# Altium schematic sheet Charging_Dock.SchDoc
size B; SheetNumber: 1; SheetTotal: 1
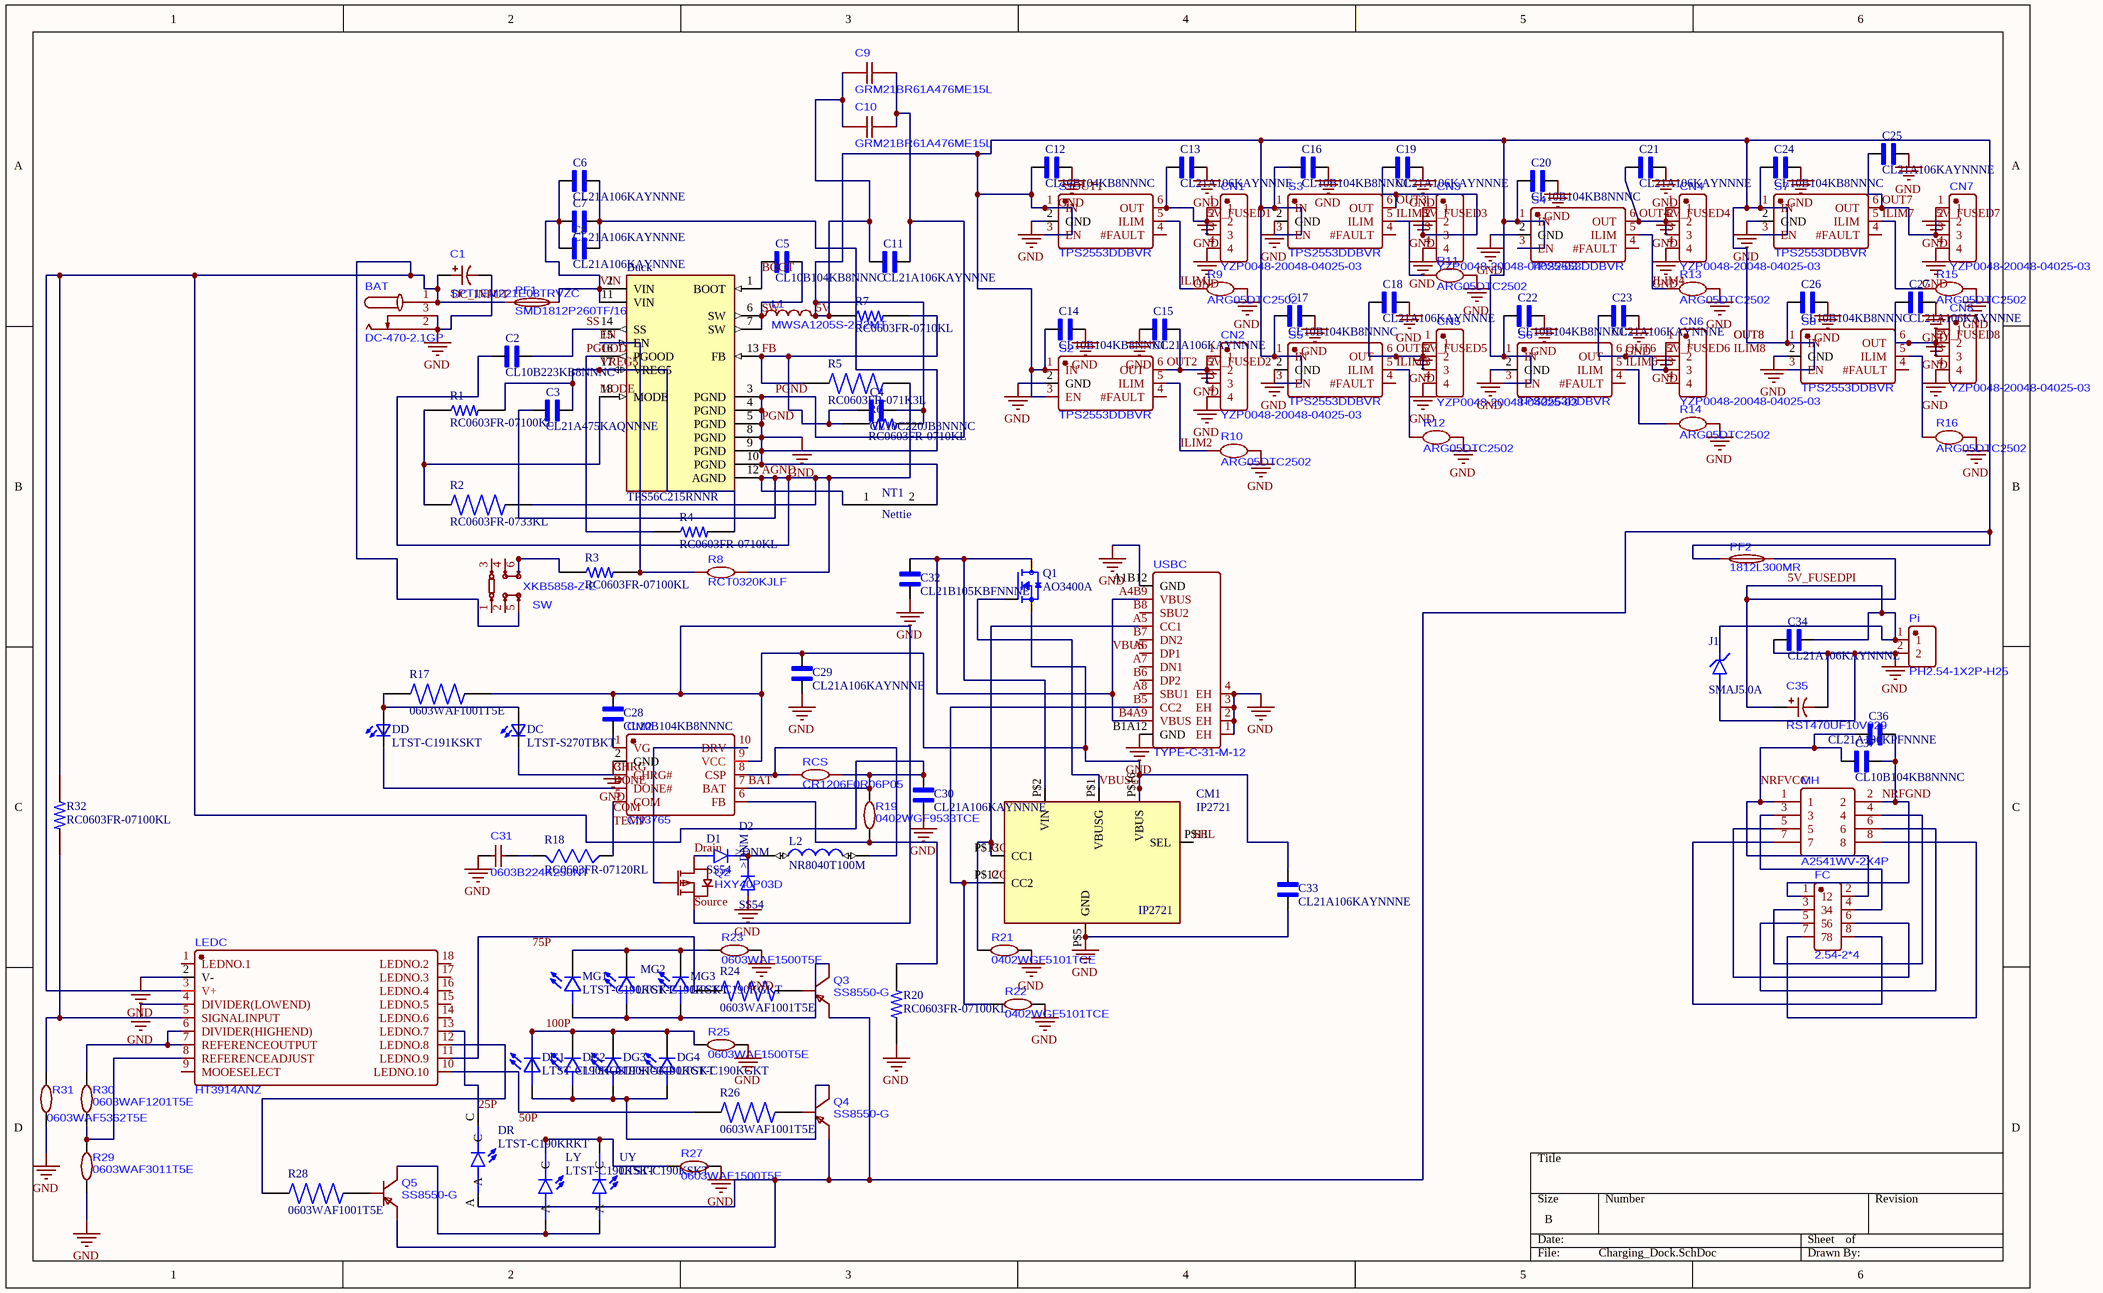
[diagram p0: Charging_Dock.SchDoc]

## Parts
BAT  DC-470-2.1GP  [DC-IN-TH_DC-470-2.1GP]
Buck  TPS56C215RNNR  [QFN50P350X350X100-18N]
C1  SPT1EM221E08TRVZC  [CAP-SMD_BD6.3-L6.6-W6.6-LS7.3-FD]
C2  CL10B223KB8NNNC  [CAPC1608X90N]
C3  CL21A475KAQNNNE  [CAPC2012X140N]
C4  CL10C220JB8NNNC  [CAPC1608X90N]
C5  CL10B104KB8NNNC  [CAPC1608X90N]
C6  CL21A106KAYNNNE  [CAPC2012X145N]
C7  CL21A106KAYNNNE  [CAPC2012X145N]
C8  CL21A106KAYNNNE  [CAPC2012X145N]
C9  GRM21BR61A476ME15L  [C0805]
C10  GRM21BR61A476ME15L  [C0805]
C11  CL21A106KAYNNNE  [CAPC2012X145N]
C12  CL10B104KB8NNNC  [CAPC1608X90N]
C13  CL21A106KAYNNNE  [CAPC2012X145N]
C14  CL10B104KB8NNNC  [CAPC1608X90N]
C15  CL21A106KAYNNNE  [CAPC2012X145N]
C16  CL10B104KB8NNNC  [CAPC1608X90N]
C17  CL10B104KB8NNNC  [CAPC1608X90N]
C18  CL21A106KAYNNNE  [CAPC2012X145N]
C19  CL21A106KAYNNNE  [CAPC2012X145N]
C20  CL10B104KB8NNNC  [CAPC1608X90N]
C21  CL21A106KAYNNNE  [CAPC2012X145N]
C22  CL10B104KB8NNNC  [CAPC1608X90N]
C23  CL21A106KAYNNNE  [CAPC2012X145N]
C24  CL10B104KB8NNNC  [CAPC1608X90N]
C25  CL21A106KAYNNNE  [CAPC2012X145N]
C26  CL10B104KB8NNNC  [CAPC1608X90N]
C27  CL21A106KAYNNNE  [CAPC2012X145N]
C28  CL10B104KB8NNNC  [CAPC1608X90N]
C29  CL21A106KAYNNNE  [CAPC2012X145N]
C30  CL21A106KAYNNNE  [CAPC2012X145N]
C31  0603B224K250NT  [C0603]
C32  CL21B105KBFNNNE  [CAPC2012X135N]
C33  CL21A106KAYNNNE  [CAPC2012X145N]
C34  CL21A106KAYNNNE  [CAPC2012X145N]
C35  RST470UF10V029  [CAP-SMD_BD6.3-L6.6-W6.6-LS7.2-FD]
C36  CL21A106KPFNNNE  [CAPC2012X135N]
C37  CL10B104KB8NNNC  [CAPC1608X90N]
CM1  IP2721  [TSSOP16]
CM2  CN3765  [SSOP-10_L4.9-W3.9-P1.00-LS6.0-BL]
CN1  YZP0048-20048-04025-03  [CONN-SMD_4P-P2.50-YZP0048-20048-04025-03]
CN2  YZP0048-20048-04025-03  [CONN-SMD_4P-P2.50-YZP0048-20048-04025-03]
CN3  YZP0048-20048-04025-03  [CONN-SMD_4P-P2.50-YZP0048-20048-04025-03]
CN4  YZP0048-20048-04025-03  [CONN-SMD_4P-P2.50-YZP0048-20048-04025-03]
CN5  YZP0048-20048-04025-03  [CONN-SMD_4P-P2.50-YZP0048-20048-04025-03]
CN6  YZP0048-20048-04025-03  [CONN-SMD_4P-P2.50-YZP0048-20048-04025-03]
CN7  YZP0048-20048-04025-03  [CONN-SMD_4P-P2.50-YZP0048-20048-04025-03]
CN8  YZP0048-20048-04025-03  [CONN-SMD_4P-P2.50-YZP0048-20048-04025-03]
D1  SS54  [DO-214AC]
D2  SS54  [DO-214AC]
DC  LTST-S270TBKT  [0603]
DD  LTST-C191KSKT  [0603]
DG1  LTST-C190KGKT  [LEDC1608X35N]
DG2  LTST-C190KGKT  [LEDC1608X35N]
DG3  LTST-C190KGKT  [LEDC1608X35N]
DG4  LTST-C190KGKT  [LEDC1608X35N]
DR  LTST-C190KRKT  [LEDC1608X35N]
FC  2.54-2*4  [HDR-TH_8P-P2.54-V-F-R2-C4-S2.54]
J1  SMAJ5.0A  [DO-214AA]
L1  MWSA1205S-2R2MT  [IND-SMD_L13.5-W12.6]
L2  NR8040T100M  [NR8040T220M]
LEDC  HT3914ANZ  [CDIP-18_L24.4-W6.5-P2.54-LS7.6-BL]
LY  LTST-C190KSKT  [LEDM1608X80]
MG1  LTST-C190KGKT  [LEDC1608X35N]
MG2  LTST-C190KGKT  [LEDC1608X35N]
MG3  LTST-C190KGKT  [LEDC1608X35N]
MH  A2541WV-2X4P  [HDR-TH_8P-P2.54-V-R2-C4-S2.54_A2541WV-2X4P]
NT1  Nettie  [Nettie]  (net tie, no BOM)
PF1  SMD1812P260TF/16  [F1812]
PF2  1812L300MR  [F1812]
Pi  PH2.54-1X2P-H25  [HDR-TH_2P-P2.54-V-M-4]
Q1  AO3400A  [SOT95P280X125-3N]
Q2  HXY40P03D  [TO-252-2_L6.6-W6.1-P4.57-LS10.1-BR-CW]
Q3  SS8550-G  [SOT-23-3_L2.9-W1.6-P1.90-LS2.8-BR]
Q4  SS8550-G  [SOT-23-3_L2.9-W1.6-P1.90-LS2.8-BR]
Q5  SS8550-G  [SOT-23-3_L2.9-W1.6-P1.90-LS2.8-BR]
R1  RC0603FR-07100KL  [RESC1607X60N]
R2  RC0603FR-0733KL  [RESC1607X60N]
R3  RC0603FR-07100KL  [RESC1607X60N]
R4  RC0603FR-0710KL  [RESC1607X60N]
R5  RC0603FR-071K3L  [RESC1608X55N]
R6  RC0603FR-0710KL  [RESC1607X60N]
R7  RC0603FR-0710KL  [RESC1607X60N]
R8  RCT0320KJLF  [R0603]
R9  ARG05DTC2502  [R0805]
R10  ARG05DTC2502  [R0805]
R11  ARG05DTC2502  [R0805]
R12  ARG05DTC2502  [R0805]
R13  ARG05DTC2502  [R0805]
R14  ARG05DTC2502  [R0805]
R15  ARG05DTC2502  [R0805]
R16  ARG05DTC2502  [R0805]
R17  0603WAF1001T5E  [RESC1608X55N]
R18  RC0603FR-07120RL  [RESC1608X55]
R19  0402WGF9533TCE  [R0402]
R20  RC0603FR-07100KL  [RESC1607X60N]
R21  0402WGF5101TCE  [R0402]
R22  0402WGF5101TCE  [R0402]
R23  0603WAF1500T5E  [R0603]
R24  0603WAF1001T5E  [RESC1608X55N]
R25  0603WAF1500T5E  [R0603]
R26  0603WAF1001T5E  [RESC1608X55N]
R27  0603WAF1500T5E  [R0603]
R28  0603WAF1001T5E  [RESC1608X55N]
R29  0603WAF3011T5E  [R0603]
R30  0603WAF1201T5E  [R0603]
R31  0603WAF5362T5E  [R0603]
R32  RC0603FR-07100KL  [RESC1607X60N]
RCS  CR1206F0R06P05  [R1206]
S1  TPS2553DDBVR  [SOT-23-6_L2.9-W1.6-P0.95-LS2.8-BL]
S2  TPS2553DDBVR  [SOT-23-6_L2.9-W1.6-P0.95-LS2.8-BL]
S3  TPS2553DDBVR  [SOT-23-6_L2.9-W1.6-P0.95-LS2.8-BL]
S4  TPS2553DDBVR  [SOT-23-6_L2.9-W1.6-P0.95-LS2.8-BL]
S5  TPS2553DDBVR  [SOT-23-6_L2.9-W1.6-P0.95-LS2.8-BL]
S6  TPS2553DDBVR  [SOT-23-6_L2.9-W1.6-P0.95-LS2.8-BL]
S7  TPS2553DDBVR  [SOT-23-6_L2.9-W1.6-P0.95-LS2.8-BL]
S8  TPS2553DDBVR  [SOT-23-6_L2.9-W1.6-P0.95-LS2.8-BL]
SW  XKB5858-Z-E  [SW-TH_XKB5858-Z-E]
USBC  TYPE-C-31-M-12  [USB-C_SMD-TYPE-C-31-M-12_1]
UY  LTST-C190KSKT  [LEDM1608X80]

## Nets
PGND: BAT.2 BAT.3 Buck.3(PGND) Buck.4(PGND) Buck.5(PGND) Buck.8(PGND) Buck.9(PGND) Buck.10(PGND) C1.2 C6.2 C7.2 C8.2 C9.1 C10.1 C11.2 C12.2 C13.2 C14.2 C15.1 C16.2 C17.2 C18.2 C19.2 C20.2 C21.2 C22.2 C23.2 C24.2 C25.2 C26.2 C27.2 C29.1 C30.1 C31.1 C32.1 C33.1 C34.1 C35.2 CM1.P$5(GND) CM2.2(GND) CN1.1 CN1.4 CN2.1 CN2.4 CN3.1 CN3.4 CN4.1 CN4.4 CN5.1 CN5.4 CN6.1 CN7.1 CN7.4 CN8.1 CN8.4 D2.A(ANODE) J1.A LEDC.2(V-) LEDC.4(DIVIDER(LOWEND)) NT1.2 Pi.2 R9.2 R10.2 R11.2 R12.2 R13.2 R14.2 R15.2 R16.2 R20.1 R21.2 R22.2 R23.2 R25.2 R27.2 R29.1 R31.1 S1.2(GND) S2.2(GND) S3.2(GND) S4.2(GND) S5.2(GND) S6.2(GND) S7.2(GND) S8.2(GND) USBC.1(EH) USBC.2(EH) USBC.3(EH) USBC.4(EH) USBC.A1B12(GND) USBC.B1A12(GND)  [also labelled GND]
5V: C4.1 C9.2 C10.2 C11.1 C12.1 C14.1 C16.1 C17.1 C20.1 C22.1 C24.1 C26.1 DR.A L1.2 PF2.1 Q3.2(E) Q4.2(E) Q5.2(E) R6.2 R7.1 S1.1(IN) S1.3(EN) S2.1(IN) S2.3(EN) S3.1(IN) S3.3(EN) S4.1(IN) S4.3(EN) S5.1(IN) S5.3(EN) S6.1(IN) S6.3(EN) S7.1(IN) S7.3(EN) S8.1(IN) S8.3(EN)
5V_FUSED1: C13.1 CN1.2 CN1.3 S1.6(OUT)
5V_FUSED2: C15.2 CN2.2 CN2.3 S2.6(OUT)  [also labelled OUT2]
5V_FUSED3: C19.1 CN3.2 CN3.3 S3.6(OUT)  [also labelled OUT3]
5V_FUSED4: C21.1 CN4.2 CN4.3 S4.6(OUT)  [also labelled OUT4]
5V_FUSED5: C18.1 CN5.2 CN5.3 S5.6(OUT)  [also labelled OUT5]
5V_FUSED6: C23.1 CN6.2 CN6.3 S6.6(OUT)  [also labelled OUT6]
5V_FUSED7: C25.1 CN7.2 CN7.3 S7.6(OUT)  [also labelled OUT7]
5V_FUSED8: C27.1 CN8.2 CN8.3 S8.6(OUT)
5V_FUSEDPI: C34.2 C35.1 J1.C PF2.2 Pi.1
25P: DR.C LEDC.13(LEDNO.7)
100P: DG1.C DG2.C DG3.C DG4.C R25.1
AGND: Buck.12(AGND) C2.1 C3.1 NT1.1 R2.2 R5.2 R8.2
BAT: BAT.1 C1.1 C30.2 CM2.7(BAT) LEDC.3(V+) PF1.1 R19.2 R32.1 RCS.2 SW.5  [also labelled DC_INPUT]
BOOT: Buck.1(BOOT) C5.1
CC1: CM1.P$13(CC1) R21.1 USBC.A5(CC1)
CC2: CM1.P$12(CC2) R22.1 USBC.B5(CC2)
CHRG: CM2.3(CHRG#) DC.1(K2)
COM: CM2.5(COM) R18.2  [also labelled TEMP]
DONE: CM2.4(DONE#) DD.1(K2)
Drain: D1.A(ANODE) Q2.2(D)
EN: Buck.15(EN) R3.2 R8.1
FB: Buck.13(FB) C4.2 R5.1 R6.1 R7.2
ILIM1: R9.1 S1.5(ILIM)
ILIM2: R10.1 S2.5(ILIM)
ILIM3: R11.1 S3.5(ILIM)
ILIM4: R13.1 S4.5(ILIM)
ILIM5: R12.1 S5.5(ILIM)
ILIM6: R14.1 S6.5(ILIM)
ILIM7: R15.1 S7.5(ILIM)
MODE: Buck.18(MODE) R1.1 R2.1
NRFGND: C36.2 C37.2 FC.1 MH.2
NRFVCC: C36.1 C37.1 FC.2 MH.1
PGOOD: Buck.16(PGOOD) R4.1
SEL: CM1.P$11(SEL)
Source: C28.2 C29.2 C33.2 CM1.P$16(VBUS) CM2.9(VCC) Q1.2(S) Q2.3(S) R17.2
SS: Buck.14(SS) C2.2
SW: Buck.6(SW) Buck.7(SW) C5.2 L1.1
VBUS: C32.2 CM1.P$2(VIN) Q1.3(D) USBC.A4B9(VBUS) USBC.B4A9(VBUS)
VBUSG: CM1.P$1(VBUSG) Q1.1(G)
VIN: Buck.2(VIN) Buck.11(VIN) C6.1 C7.1 C8.1 PF1.2
VREG5: Buck.17(VREG5) C3.2 R1.2 R4.2
NetC28_1: C28.1 CM2.1(VG)
NetC31_2: C31.2 R18.1
NetCM2_6: CM2.6(FB) R19.1 R20.2
NetCM2_8: CM2.8(CSP) L2.2 RCS.1
NetCM2_10: CM2.10(DRV) Q2.1(G)
NetD1_C: D1.C(CATHODE) D2.C(CATHODE) L2.1
NetDC_2: DC.2(A2) DD.2(A2) R17.1
NetDG1_A: DG1.A DG2.A DG3.A DG4.A Q4.3(C)
NetFC_3: FC.3 MH.4
NetFC_4: FC.4 MH.3
NetFC_5: FC.5 MH.6
NetFC_6: FC.6 MH.5
NetFC_7: FC.7 MH.8
NetFC_8: FC.8 MH.7
NetLEDC_5: LEDC.5(SIGNALINPUT) R31.2 R32.2
NetLEDC_6: LEDC.6(DIVIDER(HIGHEND)) LEDC.7(REFERENCEOUTPUT) R30.2
NetLEDC_8: LEDC.8(REFERENCEADJUST) R29.2 R30.1
NetLEDC_10: LEDC.10(LEDNO.10) R26.1
NetLEDC_11: LEDC.11(LEDNO.9) R24.1
NetLEDC_12: LEDC.12(LEDNO.8) R28.1
NetLY_A: LY.A Q5.3(C) UY.A
NetLY_C: LY.C R27.1 UY.C
NetMG1_A: MG1.A MG2.A MG3.A Q3.3(C)
NetMG1_C: MG1.C MG2.C MG3.C R23.1
NetQ3_1: Q3.1(B) R24.2
NetQ4_1: Q4.1(B) R26.2
NetQ5_1: Q5.1(B) R28.2
NetR3_1: R3.1 SW.6
NetR16_1: R16.1 S8.5(ILIM)

Not connected (* = marked no-connect by the designer): CN6 4; LEDC 1(LEDNO.1) 9(MOOESELECT) 14(LEDNO.6) 15(LEDNO.5) 16(LEDNO.4) 17(LEDNO.3) 18(LEDNO.2); S1 4(#FAULT); S2 4(#FAULT); S3 4(#FAULT); S4 4(#FAULT); S5 4(#FAULT); S6 4(#FAULT); S7 4(#FAULT); S8 4(#FAULT); SW 1 2 3 4; USBC A6(DP1) A7(DN1) A8(SBU1) B6(DP2) B7(DN2) B8(SBU2)

## Notes on the sheet
- Labels drawn without touching a wire or pin: 50P, 75P, ILIM8, OUT1
- (in symbol SS54) >DNM

## Library data of the parts
Buck = TPS56C215RNNR: 3.8-V to 17-V, 12-A synchronous SWIFTâ„¢ buck converter with D-CAP3 control; MF: Texas Instruments; SnapEDA_Link: https://www.snapeda.com/parts/TPS56C215RNNR/Texas+Instruments/view-part/?ref=snap; Package: VQFN-HR-18 Texas Instruments; Value: *; MP: TPS56C215RNNR; Check_prices: https://www.snapeda.com/parts/TPS56C215RNNR/Texas+Instruments/view-part/?ref=eda
C1 = SPT1EM221E08TRVZC: 220uF
C2 = CL10B223KB8NNNC: 0.022 ÂµF Â±10% 50V Ceramic Capacitor X7R 0603 (1608 Metric); MF: Samsung; SnapEDA_Link: https://www.snapeda.com/parts/CL10B223KB8NNNC/Samsung/view-part/?ref=snap; Package: SMD-2 Samsung; Value: *; MP: CL10B223KB8NNNC; Check_prices: https://www.snapeda.com/parts/CL10B223KB8NNNC/Samsung/view-part/?ref=eda
C3 = CL21A475KAQNNNE: 4.7 ÂµF Â±10% 25V Ceramic Capacitor X5R 0805 (2012 Metric); MF: Samsung Electro-Mechanics; SnapEDA_Link: https://www.snapeda.com/parts/CL21A475KAQNNNE/Samsung/view-part/?ref=snap; Package: SMD-2 Samsung; Value: *; MP: CL21A475KAQNNNE; Check_prices: https://www.snapeda.com/parts/CL21A475KAQNNNE/Samsung/view-part/?ref=eda
C4 = CL10C220JB8NNNC: 22 pF Â±5% 50V Ceramic Capacitor C0G, NP0 0603 (1608 Metric); MF: Samsung Electro-Mechanics; SnapEDA_Link: https://www.snapeda.com/parts/CL10C220JB8NNNC/Samsung/view-part/?ref=snap; Package: SMD-2 Samsung; Value: *; MP: CL10C220JB8NNNC; Check_prices: https://www.snapeda.com/parts/CL10C220JB8NNNC/Samsung/view-part/?ref=eda
C5 C12 C14 C16 C17 C20 C22 C24 C26 C28 C37 = CL10B104KB8NNNC: 0.1 ÂµF Â±10% 50V Ceramic Capacitor X7R 0603 (1608 Metric); MF: Samsung Electro-Mechanics; SnapEDA_Link: https://www.snapeda.com/parts/CL10B104KB8NNNC/Samsung/view-part/?ref=snap; Package: SMD-2 Samsung; Value: *; MP: CL10B104KB8NNNC; Check_prices: https://www.snapeda.com/parts/CL10B104KB8NNNC/Samsung/view-part/?ref=eda
C6-C8 C11 C13 C15 C18 C19 C21 C23 C25 C27 C29 C30 C33 C34 = CL21A106KAYNNNE: 10 ÂµF Â±10% 25V Ceramic Capacitor X5R 0805 (2012 Metric); MF: Samsung; SnapEDA_Link: https://www.snapeda.com/parts/CL21A106KAYNNNE/Samsung/view-part/?ref=snap; Package: SMD-2 Samsung; Value: *; MP: CL21A106KAYNNNE; Check_prices: https://www.snapeda.com/parts/CL21A106KAYNNNE/Samsung/view-part/?ref=eda
C9 C10 = GRM21BR61A476ME15L: 47uF
C31 = 0603B224K250NT: 220nF
C32 = CL21B105KBFNNNE: 1 ÂµF Â±10% 50V Ceramic Capacitor X7R 0805 (2012 Metric); MF: Samsung; SnapEDA_Link: https://www.snapeda.com/parts/CL21B105KBFNNNE/Samsung/view-part/?ref=snap; Package: SMD-2 Samsung; Value: *; MP: CL21B105KBFNNNE; Check_prices: https://www.snapeda.com/parts/CL21B105KBFNNNE/Samsung/view-part/?ref=eda
C35 = RST470UF10V029: 470uF
C36 = CL21A106KPFNNNE: 10 ÂµF Â±10% 10V Ceramic Capacitor X5R 0805 (2012 Metric); MF: Samsung; SnapEDA_Link: https://www.snapeda.com/parts/CL21A106KPFNNNE/Samsung/view-part/?ref=snap; Package: SMD-2 Samsung; Value: *; MP: CL21A106KPFNNNE; Check_prices: https://www.snapeda.com/parts/CL21A106KPFNNNE/Samsung/view-part/?ref=eda
CM1 = IP2721: PD3.0 Physical Layer IC for USB TYPE-C input Interfaces; MF: Injoinic; SnapEDA_Link: https://www.snapeda.com/parts/IP2721/Injoinic/view-part/?ref=snap; Package: Package; Value: *; MP: IP2721; Check_prices: https://www.snapeda.com/parts/IP2721/Injoinic/view-part/?ref=eda
D1 D2 = SS54: Digital Switch Unipolar Switch Open Collector Hall Effect SOT-89B; MF: Honeywell Sensing; SnapEDA_Link: https://www.snapeda.com/parts/SS54/Honeywell+Sensing+and+Productivity+Solutions/view-part/?ref=snap; Package: TO-243AA-243 Honeywell Sensing; Value: *; MP: SS54; Check_prices: https://www.snapeda.com/parts/SS54/Honeywell+Sensing+and+Productivity+Solutions/view-part/?ref=eda
DC = LTST-S270TBKT: Blue 470nm LED Indication - Discrete 3.3V 0603 (1608 Metric); MF: Lite-On Inc.; SnapEDA_Link: https://www.snapeda.com/parts/LTST-S270TBKT/Lite-On/view-part/?ref=snap; Package: SMD-2 Lite-On; Value: *; MP: LTST-S270TBKT; Check_prices: https://www.snapeda.com/parts/LTST-S270TBKT/Lite-On/view-part/?ref=eda
DD = LTST-C191KSKT: Yellow 591nm LED Indication - Discrete 2.1V 0603 (1608 Metric); MF: Lite-On Inc.; SnapEDA_Link: https://www.snapeda.com/parts/LTST-C191KSKT/Lite-On/view-part/?ref=snap; Package: 0603 Lite-On Inc.; Value: *; MP: LTST-C191KSKT; Check_prices: https://www.snapeda.com/parts/LTST-C191KSKT/Lite-On/view-part/?ref=eda
DG1-DG4 MG1-MG3 = LTST-C190KGKT: MF: {'manufacturer': u'Lite-On Inc.'}; Package: None; Price: None; Value: *; MP: LTST-C190KGKT; Availability: Unavailable
DR = LTST-C190KRKT: Red 631nm LED Indication - Discrete 2V 0603 (1608 Metric); MF: Lite-On Inc.; Check_prices: https://www.snapeda.com/parts/LTST-C190KRKT/Lite-On+Inc./view-part/?ref=eda; Value: *; Purchase-URL: https://pricing.snapeda.com/search/part/LTST-C190KRKT/?ref=eda; Price: None; MP: LTST-C190KRKT; SnapEDA_Link: https://www.snapeda.com/parts/LTST-C190KRKT/Lite-On+Inc./view-part/?ref=snap; Availability: In Stock; Package: 0603 Lite-On
J1 = SMAJ5.0A: 9.2V Clamp 43.5A Ipp Tvs Diode Surface Mount DO-214AC (SMA); MF: Littelfuse; SnapEDA_Link: https://www.snapeda.com/parts/SMAJ5.0A/Littelfuse/view-part/?ref=snap; Package: DO-214 Littelfuse; Value: *; MP: SMAJ5.0A; Check_prices: https://www.snapeda.com/parts/SMAJ5.0A/Littelfuse/view-part/?ref=eda
L1 = MWSA1205S-2R2MT: 2.2uH
L2 = NR8040T100M: 10 ÂµH Shielded Drum Core, Wirewound Inductor 3.1 A 44.2mOhm Max Nonstandard; MF: Taiyo Yuden; SnapEDA_Link: https://www.snapeda.com/parts/NR8040T100M/Littelfuse/view-part/?ref=snap; Package: Nonstandard Taiyo Yuden; Value: *; MP: NR8040T100M; Check_prices: https://www.snapeda.com/parts/NR8040T100M/Littelfuse/view-part/?ref=eda
LY UY = LTST-C190KSKT: MF: {'manufacturer': u'Lite-On Inc.'}; Package: None; Price: None; Value: *; MP: LTST-C190KSKT; Availability: Unavailable
PF1 = SMD1812P260TF/16_C438899
Q1 = AO3400A: N-Channel 30 V 5.7A (Ta) 1.4W (Ta) Surface Mount SOT-23-3; MF: Alpha & Omega Semiconductor; SnapEDA_Link: https://www.snapeda.com/parts/AO3400A/Alpha/view-part/?ref=snap; Package: SOT-23 Alpha &amp; Omega Semiconductor Inc.; Value: *; MP: AO3400A; Check_prices: https://www.snapeda.com/parts/AO3400A/Alpha/view-part/?ref=eda
R1 R3 R20 R32 = RC0603FR-07100KL: 100 kOhms Â±1% 0.1W, 1/10W Chip Resistor 0603 (1608 Metric) Moisture Resistant Thick Film; MF: Yageo; SnapEDA_Link: https://www.snapeda.com/parts/RC0603FR-07100KL/Yageo/view-part/?ref=snap; Package: 0603 Yageo; Value: *; MP: RC0603FR-07100KL; Check_prices: https://www.snapeda.com/parts/RC0603FR-07100KL/Yageo/view-part/?ref=eda
R2 = RC0603FR-0733KL: RES, 33K, 1%, 0.1W, 0603, THICK FILM; Resistor Case Style:0603 [1608 Metric]; Resistance:33kohm; Product Range:RC Series; Voltage Rating:75V; Resistor Element Material:Thick Film; Power Rating:100mW; Resistance Tolerance:Â± 1%; Temperature Coefficient:Â±; MF: Yageo Corporation; MP: RC0603FR0733KL; SnapEDA_Link: https://www.snapeda.com/parts/RC0603FR0733KL/Yageo/view-part/?ref=snap; Package: 0603-2 YAGEO; Value: *; Check_prices: https://www.snapeda.com/parts/RC0603FR0733KL/Yageo/view-part/?ref=eda
R4 R6 R7 = RC0603FR-0710KL: 10 kOhms Â±1% 0.1W, 1/10W Chip Resistor 0603 (1608 Metric) Moisture Resistant Thick Film; MF: Yageo; SnapEDA_Link: https://www.snapeda.com/parts/RC0603FR-0710KL/Yageo/view-part/?ref=snap; Package: 0603 Yageo; Value: *; MP: RC0603FR-0710KL; Check_prices: https://www.snapeda.com/parts/RC0603FR-0710KL/Yageo/view-part/?ref=eda
R5 = RC0603FR-071K3L: 1.3 kOhms Â±1% 0.1W, 1/10W Chip Resistor 0603 (1608 Metric) Moisture Resistant Thick Film; MF: Yageo; SnapEDA_Link: https://www.snapeda.com/parts/RC0603FR-071K3L/Yageo/view-part/?ref=snap; Package: 1608 Yageo; Value: *; MP: RC0603FR-071K3L; Check_prices: https://www.snapeda.com/parts/RC0603FR-071K3L/Yageo/view-part/?ref=eda
R8 = RCT0320KJLF: 20kΩ
R9-R16 = ARG05DTC2502: 25kΩ
R17 R24 R26 R28 = 0603WAF1001T5E: 1K Ohm 1/10W Thick Film Resistor 0603 Chip - Surface Mount; MF: Uni-Royal; SnapEDA_Link: https://www.snapeda.com/parts/0603WAF1001T5E/Uni-Royal/view-part/?ref=snap; Package: 0603-2 ROYAL; Value: *; MP: 0603WAF1001T5E; Check_prices: https://www.snapeda.com/parts/0603WAF1001T5E/Uni-Royal/view-part/?ref=eda
R18 = RC0603FR-07120RL: 120 Ohms Â±1% 0.1W, 1/10W Chip Resistor 0603 (1608 Metric) Moisture Resistant Thick Film; MF: Yageo; SnapEDA_Link: https://www.snapeda.com/parts/RC0603FR-07120RL/Yageo/view-part/?ref=snap; Package: 1608 Yageo; Value: *; MP: RC0603FR-07120RL; Check_prices: https://www.snapeda.com/parts/RC0603FR-07120RL/Yageo/view-part/?ref=eda
R19 = 0402WGF9533TCE: 953kΩ
R21 R22 = 0402WGF5101TCE: 5.1kΩ
R23 R25 R27 = 0603WAF1500T5E: 150Ω
R29 = 0603WAF3011T5E: 3.01kΩ
R30 = 0603WAF1201T5E: 1.2kΩ
R31 = 0603WAF5362T5E: 53.6kΩ
RCS = CR1206F0R06P05: 60mΩ